# EAGLE design i2cstump (EAGLE 9.4.1)
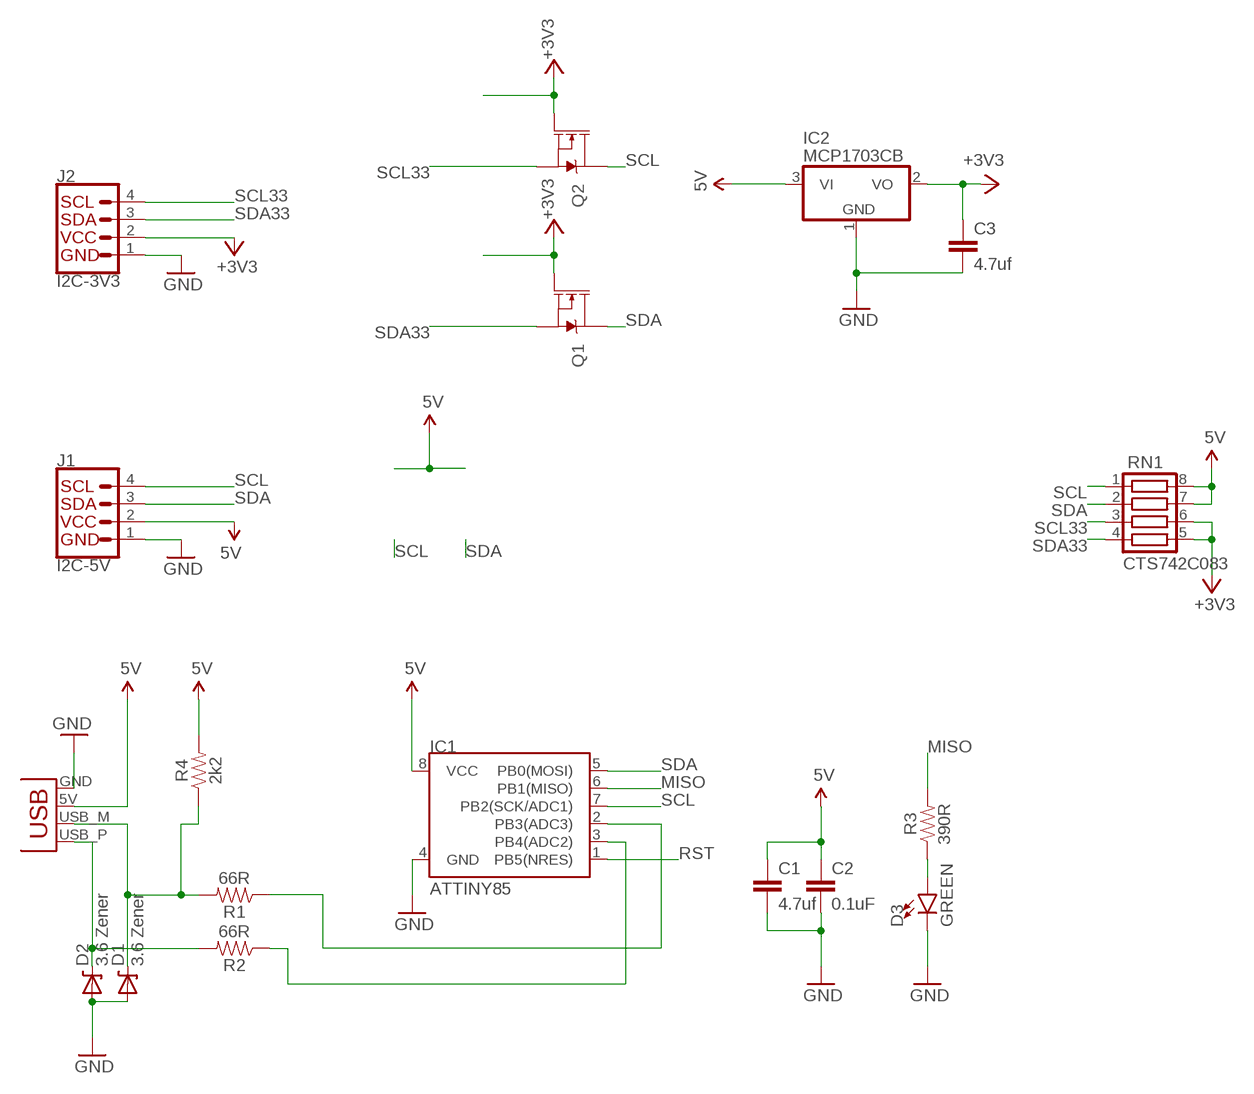
[diagram p0: schematic, sheet 1]

## Parts
C1  4.7uf  CAP0805  [0805]
C2  0.1uF  0.1UF-0603-25V-(+80/-20%)  [0603]
C3  4.7uf  CAP0805  [0805]
D1  3.6 Zener  DIODE-ZENER-BZT52  [SOD-323]
D2  3.6 Zener  DIODE-ZENER-BZT52  [SOD-323]
D3  GREEN  LED-GREEN0603  [LED-0603]
IC1  ATTINY85  ATTINY45  [SO08-EIAJ]
IC2  MCP1703CB  [SOT23]
J1  I2C-5V  QWIIC_CONNECTORJS-1MM  [1X04_1MM_RA]
J2  I2C-3V3  QWIIC_CONNECTORJS-1MM  [1X04_1MM_RA]
Q1  220mA/50V/3.5Ω  MOSFET-NCH-BSS138  [SOT23-3]
Q2  220mA/50V/3.5Ω  MOSFET-NCH-BSS138  [SOT23-3]
R1  66R  RESISTOR0603  [0603]
R2  66R  RESISTOR0603  [0603]
R3  390R  RESISTOR0603  [0603]
R4  2k2  RESISTOR0603  [0603]
RN1  CTS742C083  [CTS742C083]
X1  USBPCB  [USB-A-PCB]

## Nets
5V: C1.1 C2.1 IC1.8(VCC) IC2.3(VI) J1.2(VCC) R4.2 RN1.7 RN1.8 X1.5V(VBUS)
+3V3: C3.1 IC2.2(VO) J2.2(VCC) Q1.1(G) Q2.1(G) RN1.5 RN1.6
GND: C1.2 C2.2 C3.2 D1.2(A) D2.2(A) D3.C IC1.4(GND) IC2.1(GND) J1.1(GND) J2.1(GND) X1.GND
MISO: IC1.6(PB1(MISO)) R3.2
N$1: IC1.2(PB3(ADC3)) R1.1
N$2: D3.A R3.1
N$6: IC1.3(PB4(ADC2)) R2.1
RST: IC1.1(PB5(NRES))
SCL: IC1.7(PB2(SCK/ADC1)) J1.4(SCL) Q2.3(D) RN1.1
SCL33: J2.4(SCL) Q2.2(S) RN1.3
SDA: IC1.5(PB0(MOSI)) J1.3(SDA) Q1.3(D) RN1.2
SDA33: J2.3(SDA) Q1.2(S) RN1.4
USB_M: D1.1(C) R1.2 R4.1 X1.USB_M(D-)
USB_P: D2.1(C) R2.2 X1.USB_P(D+)

## Library data of the parts
C1 C3 = SparkFun:CAP: Capacitor Standard 0603 ceramic capacitor, and 0.1" leaded capacitor.
C2 = SparkFun-Capacitors:0.1UF: 0.1µF ceramic capacitors A capacitor is a passive two-terminal electrical component used to store electrical energy temporarily in an electric field.; PROD_ID: CAP-00810
D1 D2 = SparkFun:DIODE-ZENER: Zener Diode Production Part - 8199 3.4V Zener Voltage
D3 = SparkFun-LED:LED-GREEN: Green SMD LED Used in manufacturing of various products at SparkFun Packages: 0603 - SMD 0603 package [Product Link] <http://www.futureelectronics.com/en/technologies/semiconductors/optoelectronics/leds/Pages/9894312-LTST-C190GKT.aspx?CrossPart=HSMG-C190&IM=0> LilyPad 1206 - SMD1206 LilyPad package [Product Link] <http://www.futureelectronics.com/en/Technologies/Product.aspx?ProductID=IN150NGHARVATEKCORPORATION2049943&IM=0> 1206 - SMD1206 package [Product Link] <http://www.futureelectronics.com/en/technologies/semiconductors/optoelectronics/leds/Pages/8315665-LTST-C150KGKT.aspx?IM=0> 1206 Bottom Mount -SMD 1206 Bottom Mount [Product Link] <http://www.digikey.com/product-detail/en/lite-on-inc/LTST-C230KGKT/160-1456-1-ND/386854> SparkFun Products: Pro Mini 328 -5V <https://www.sparkfun.com/products/821> RedBoard <https://www.sparkfun.com/products/12757> MP3 Trigger <https://www.sparkfun.com/products/13720> Makey Makey <https://www.sparkfun.com/products/11076>; PROD_ID: DIO-00821
IC1 = SparkFun:ATTINY45: Atmel ATTiny45
IC2 = linear:MCP1703: 250 mA, 16V, Low Quiescent Current LDO Regulator Source: http://ww1.microchip.com/downloads/en/DeviceDoc/22049b.pdf
J1 J2 = SparkFun-Connectors:QWIIC_CONNECTOR: SparkFun I2C Standard Qwiic Connector An SMD 1mm pitch JST connector makes it easy and quick (get it? Qwiic?) to connect I2C devices to each other. The Qwiic system <http://www.sparkfun.com/qwiic> enables fast and solderless connection between popular platforms and various sensors and actuators. We carry 200mm <https://www.sparkfun.com/products/14204>, 100mm <https://www.sparkfun.com/products/14205>, 50mm <https://www.sparkfun.com/products/14206>, and breadboard friendly <https://www.sparkfun.com/products/14207> Qwiic cables. We also offer 10 pcs strips <https://www.sparkfun.com/products/14323> the SMD connectors.
Q1 Q2 = SparkFun-DiscreteSemi:MOSFET-NCH: N-channel MOSFETs Voltage controlled devices that allow control of high current outputs. SparkFun Products: SparkFun OpenScale <https://www.sparkfun.com/products/13261> SparkFun Digital Sandbox <https://www.sparkfun.com/products/12651> SparkFun Monster Moto Shield <https://www.sparkfun.com/products/10182> SparkFun MOSFET Power Controller <https://www.sparkfun.com/products/11214>; PROD_ID: TRANS-00830
R1-R4 = SparkFun-Resistors:RESISTOR: Generic Resistor Package
RN1 = resistor-net:CTS742C083: Chip Resistor Array 4 Single Resistor Source: http://www.ctscorp.com/components/Datasheets/CTSChipArrayDs.pdf; OC_FARNELL: unknown; OC_NEWARK: unknown
X1 = SparkFun:USB: USB Connectors USB-B-PTH is fully proven SKU : PRT-00139 USB-miniB is fully proven SKU : PRT-00587 USB-A-PCB is untested. USB-A-H is throughly reviewed, but untested. Spark Fun Electronics SKU : PRT-00437 USB-B-SMT is throughly reviewed, but untested. Needs silkscreen touching up. USB-A-S has not been used/tested USB-MB-H has not been used/tested

## Board
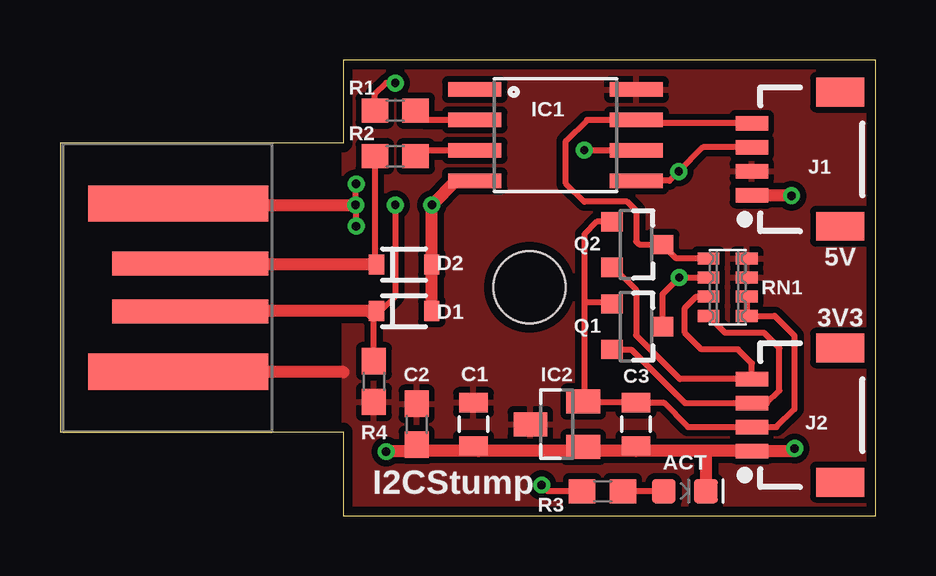
[diagram p1: board, top side]
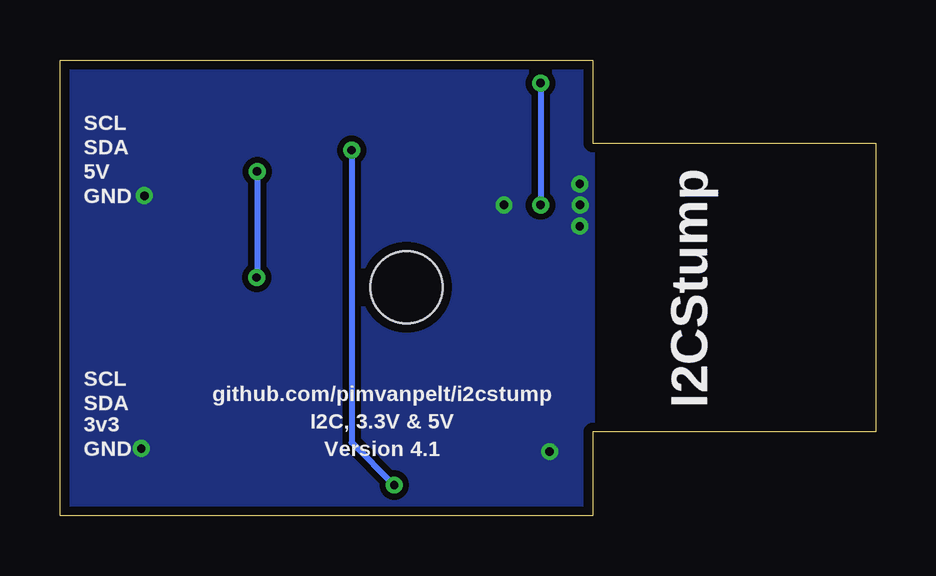
[diagram p2: board, bottom side, seen from below]

Size 33.99 x 19 mm. Coordinates in mm from the lower left corner, seen from the top.
Outline: 0,3.5 11.79,3.5 11.79,0 33.99,0 33.99,19 11.79,19 11.79,15.53 0,15.53 0,3.5
Copper layers (1*16): Top 0.0356mm / dielectric 1.5011mm / Bottom 0.0356mm
Design rules "default *": minimum track width 8mil, minimum drill 13mil, track to track 10mil, track to pad 10mil, pad to pad 10mil, via to via 10mil, smd to smd 8mil, copper to edge 15mil, drill to drill 12mil, minimum pad ring 7mil, minimum via ring 7mil, stop-mask expansion 4mil, vias tented up to drill 25mil, thermal gap 10mil
Holes 3 mm at 19.56,9.53

### Footprints (pad centres in the part's own frame; a part is rotated, then mirrored left to right if it is on the bottom)
0805 = smd 0.8 x 1.2: 1 -0.9,0; 2 0.9,0
0603 = smd 1.1 x 1: 1 -0.85,0; 2 0.85,0
SOD-323 = smd 0.63 x 0.83: 1 -1.15,0; 2 1.15,0
LED-0603 = smd 1 x 1: A -0.877,0; C 0.877,0
SO08-EIAJ = smd 0.61 x 2.21: 1 -1.905,-3.378; 2 -0.635,-3.378; 3 0.635,-3.378; 4 1.905,-3.378; 5 1.905,3.353; 6 0.635,3.353; 7 -0.635,3.353; 8 -1.905,3.353
SOT23 = smd 1 x 1.4: 1 -0.95,-1.1; 2 0.95,-1.1; 3 0,1.1
1X04_1MM_RA = smd 0.6 x 1.35: 1 -1.5,0; 2 -0.5,0; 3 0.5,0; 4 1.5,0 | smd 1.2 x 2: NC1 2.8,-3.675; NC2 -2.8,-3.675
SOT23-3 = smd 0.8 x 0.9: 1 -0.95,-1; 2 0.95,-1; 3 0,1.1
CTS742C083 = smd 0.5 x 0.9: 1 -1.2,-0.8; 2 -0.4,-0.8; 3 0.4,-0.8; 4 1.2,-0.8; 5 1.2,0.8; 6 0.4,0.8; 7 -0.4,0.8; 8 -1.2,0.8
USB-A-PCB = smd 7.5 x 1.5: 5V -0.2,-3.5; GND -0.2,3.5 | smd 6.5 x 1: USB_M 0.3,-1; USB_P 0.3,1

### Placement (x,y rotation side)
C1  17.23,3.81 270 top
C2  14.86,3.81 270 top
C3  24,3.81 270 top
D1  14.34,8.53 0 top
D2  14.34,10.47 0 top
D3  26.04,1.02 0 top
IC1  20.66,15.86 270 top
IC2  20.7,3.81 90 top
J1  28.83,14.86 90 top
J2  28.83,4.19 90 top
Q1  24,7.87 270 top
Q2  24,11.3 270 top
R1  13.97,16.89 180 top
R2  13.97,14.99 180 top
R3  22.61,1.02 180 top
R4  13.08,5.59 270 top
RN1  27.81,9.53 270 top
X1  5.13,9.5 0 top

### Tracks (layer width: path | path; a pad name or v marks a point on that pad's centre or on a via)
5V
  Top 0.508: X1.5V 11.78,6 11.81,5.97
  pour Top: 11.81,18.92 34.04,18.92 34.04,0 11.81,0
+3V3
  Top 0.254: Q2.1 22.37,12.25 21.84,11.73 21.84,8.89 | 21.84,8.89 21.84,4.76 | Q1.1 22.94,8.89 21.84,8.89 | RN1.6 RN1.5 29.77,8.32 30.61,7.49 30.61,4.45 29.85,3.69 J2.2 26.16,3.69 25.15,4.71 C3.1 21.85,4.71 IC2.2
  Top 0.508: IC2.2 21.84,4.76
GND  (via drill 0.35)
  Top 0.254: v12.34,12.06 12.32,12.06 v12.32,12.95 12.32,13.84 v12.33,13.83 v12.34,13.83
  Top 0.508: X1.GND arc90 4.97,12.95 v12.32,12.95 | D2.2 | 26.92,2.69 J2.1 30.5,2.69 v30.61,2.79 | 26.92,2.69 24,2.69 | 24,2.69 21.97,2.69 | D3.C 26.92,1.03 26.92,2.69 | J1.1 30.46,13.36 v30.48,13.33 | C3.2 24,2.69 | 21.97,2.69 IC2.1 | 21.97,2.69 17.45,2.69 | 17.45,2.69 C1.2 | 17.45,2.69 15.13,2.69 C2.2 arc-90 14.57,2.67 v13.59,2.67 | D1.2 D2.2 | D2.2 v15.49,12.95 16.5,13.96 IC1.4
  pour Bottom: 11.81,18.92 34.04,18.92 34.04,0 11.81,0
MISO  (via drill 0.35)
  Top 0.254: IC1.6 21.96,15.23 21.84,15.11 v21.84,15.24 | R3.2 20.32,1.02 v20.07,1.27
  Bottom 0.254: v21.84,15.24 21.84,3.05 v20.07,1.27
N$1
  Top 0.254: IC1.2 15.21,16.5 R1.1
N$2
  Top 0.254: D3.A R3.1
N$6
  Top 0.254: IC1.3 15.06,15.23 R2.1
SCL
  Top 0.254: RN1.1 25.68,10.72 Q2.3 24.13,11.3 24,11.43 24,12.71 23.63,13.08 21.85,13.08 21.08,13.85 21.08,15.62 21.96,16.5 IC1.7 24.15,16.36 J1.4
SCL33
  Top 0.254: RN1.3 26.5,9.12 26.04,8.66 26.04,7.62 26.72,6.93 28.25,6.93 28.83,6.35 J2.4 25.82,5.69 24,7.51 24,9.41 23.06,10.35 Q2.2
SDA  (via drill 0.35)
  Top 0.254: J1.3 26.79,15.36 v25.78,14.35 25.39,13.96 IC1.5 | Q1.3 25.1,9.23 v25.8,9.92 RN1.2
  Bottom 0.254: v25.78,14.35 25.78,9.91 v25.8,9.92
SDA33
  Top 0.254: RN1.4 27.72,7.62 29.34,7.62 29.97,6.98 29.97,5.21 29.46,4.69 J2.3 26.04,4.69 23.8,6.92 Q1.2
USB_M  (via drill 0.35)
  Top 0.254: R4.1 13.08,8.15 12.7,8.53 D1.1 13.35,8.53 13.97,9.14 v13.97,12.95 | R1.2 13.12,17.57 13.59,18.03 v13.97,18.03
  Top 0.508: D1.1 5.45,8.53 X1.USB_M
  Bottom 0.254: v13.97,18.03 v13.97,12.95
USB_P
  Top 0.254: R2.2 13.12,10.54 D2.1
  Top 0.508: D2.1 5.46,10.47 X1.USB_P

### Text on the board
tPlace: IC1 | 5V | D2 | RN1 | D1 | 3V3 | C1 | I2CStump | ACT
bPlace: SCL | SDA | 5V | GND | SCL | github.com/pimvanpelt/i2cstump / I2C, 3.3V & 5V / Version 4.1 | 3v3 | SDA | GND
bNames: I2CStump